# EAGLE schematic BusPirate-ultra.v1.0b (EAGLE 9.1.3)
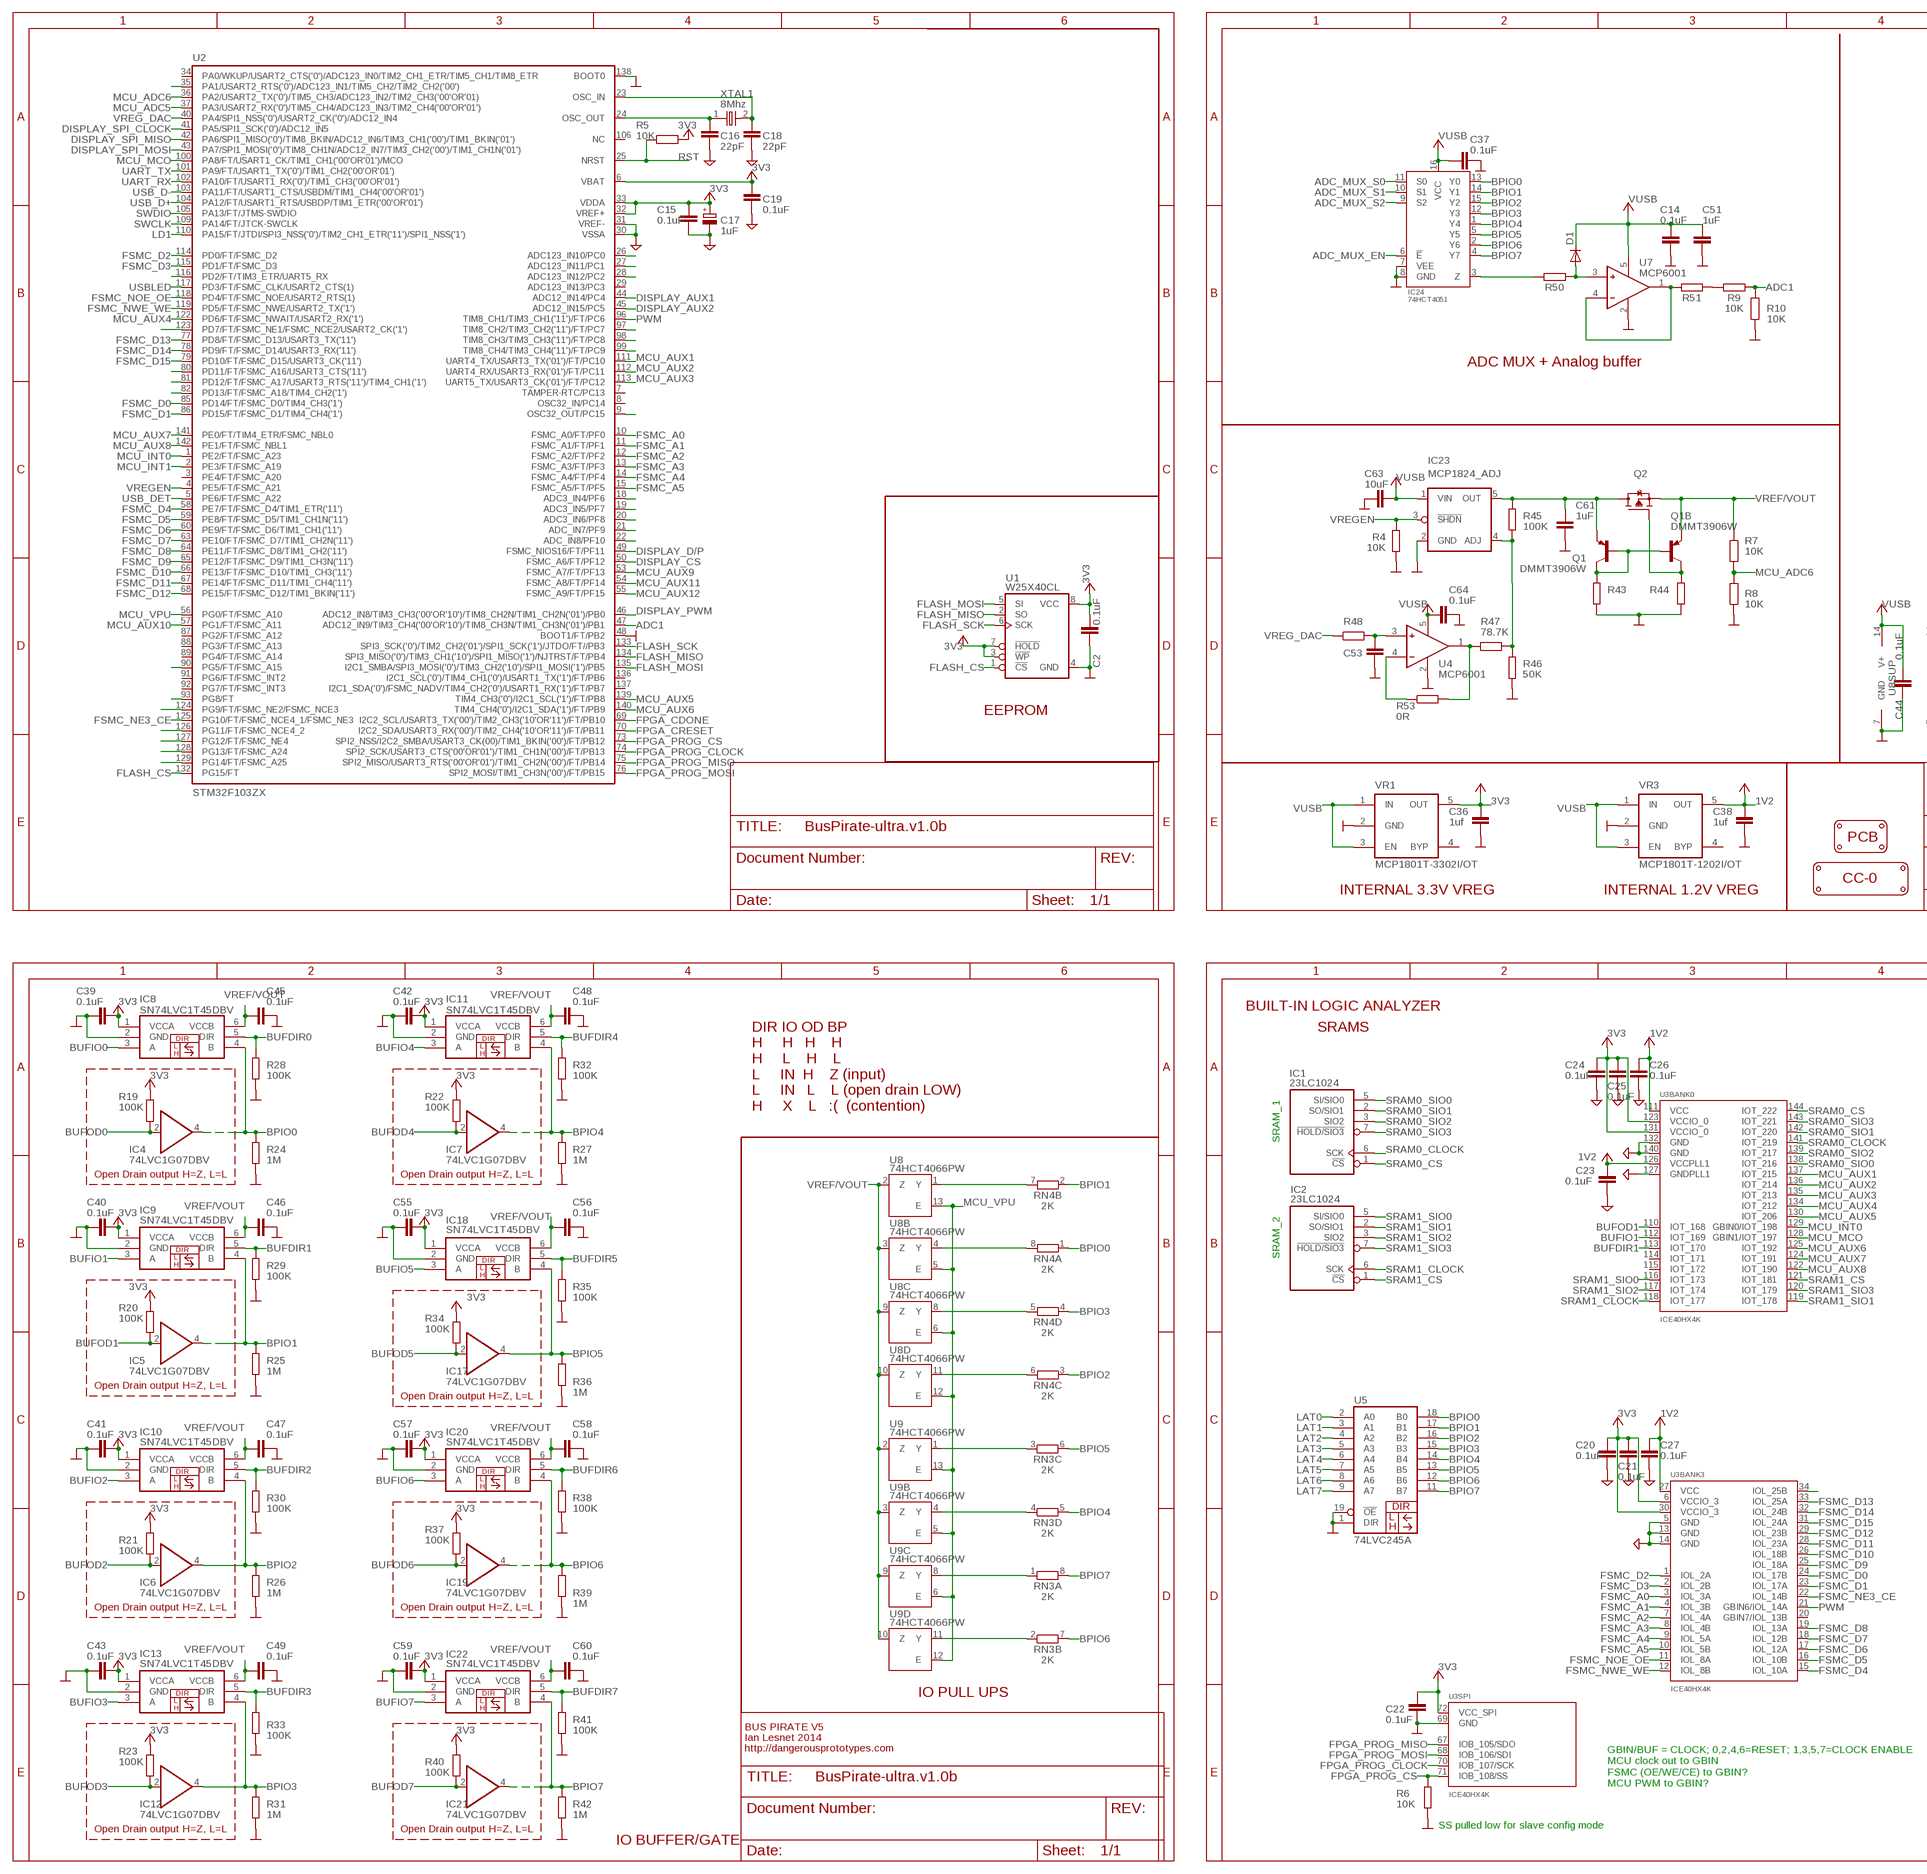
[diagram p0: schematic, sheet 1, part 1 of 2]
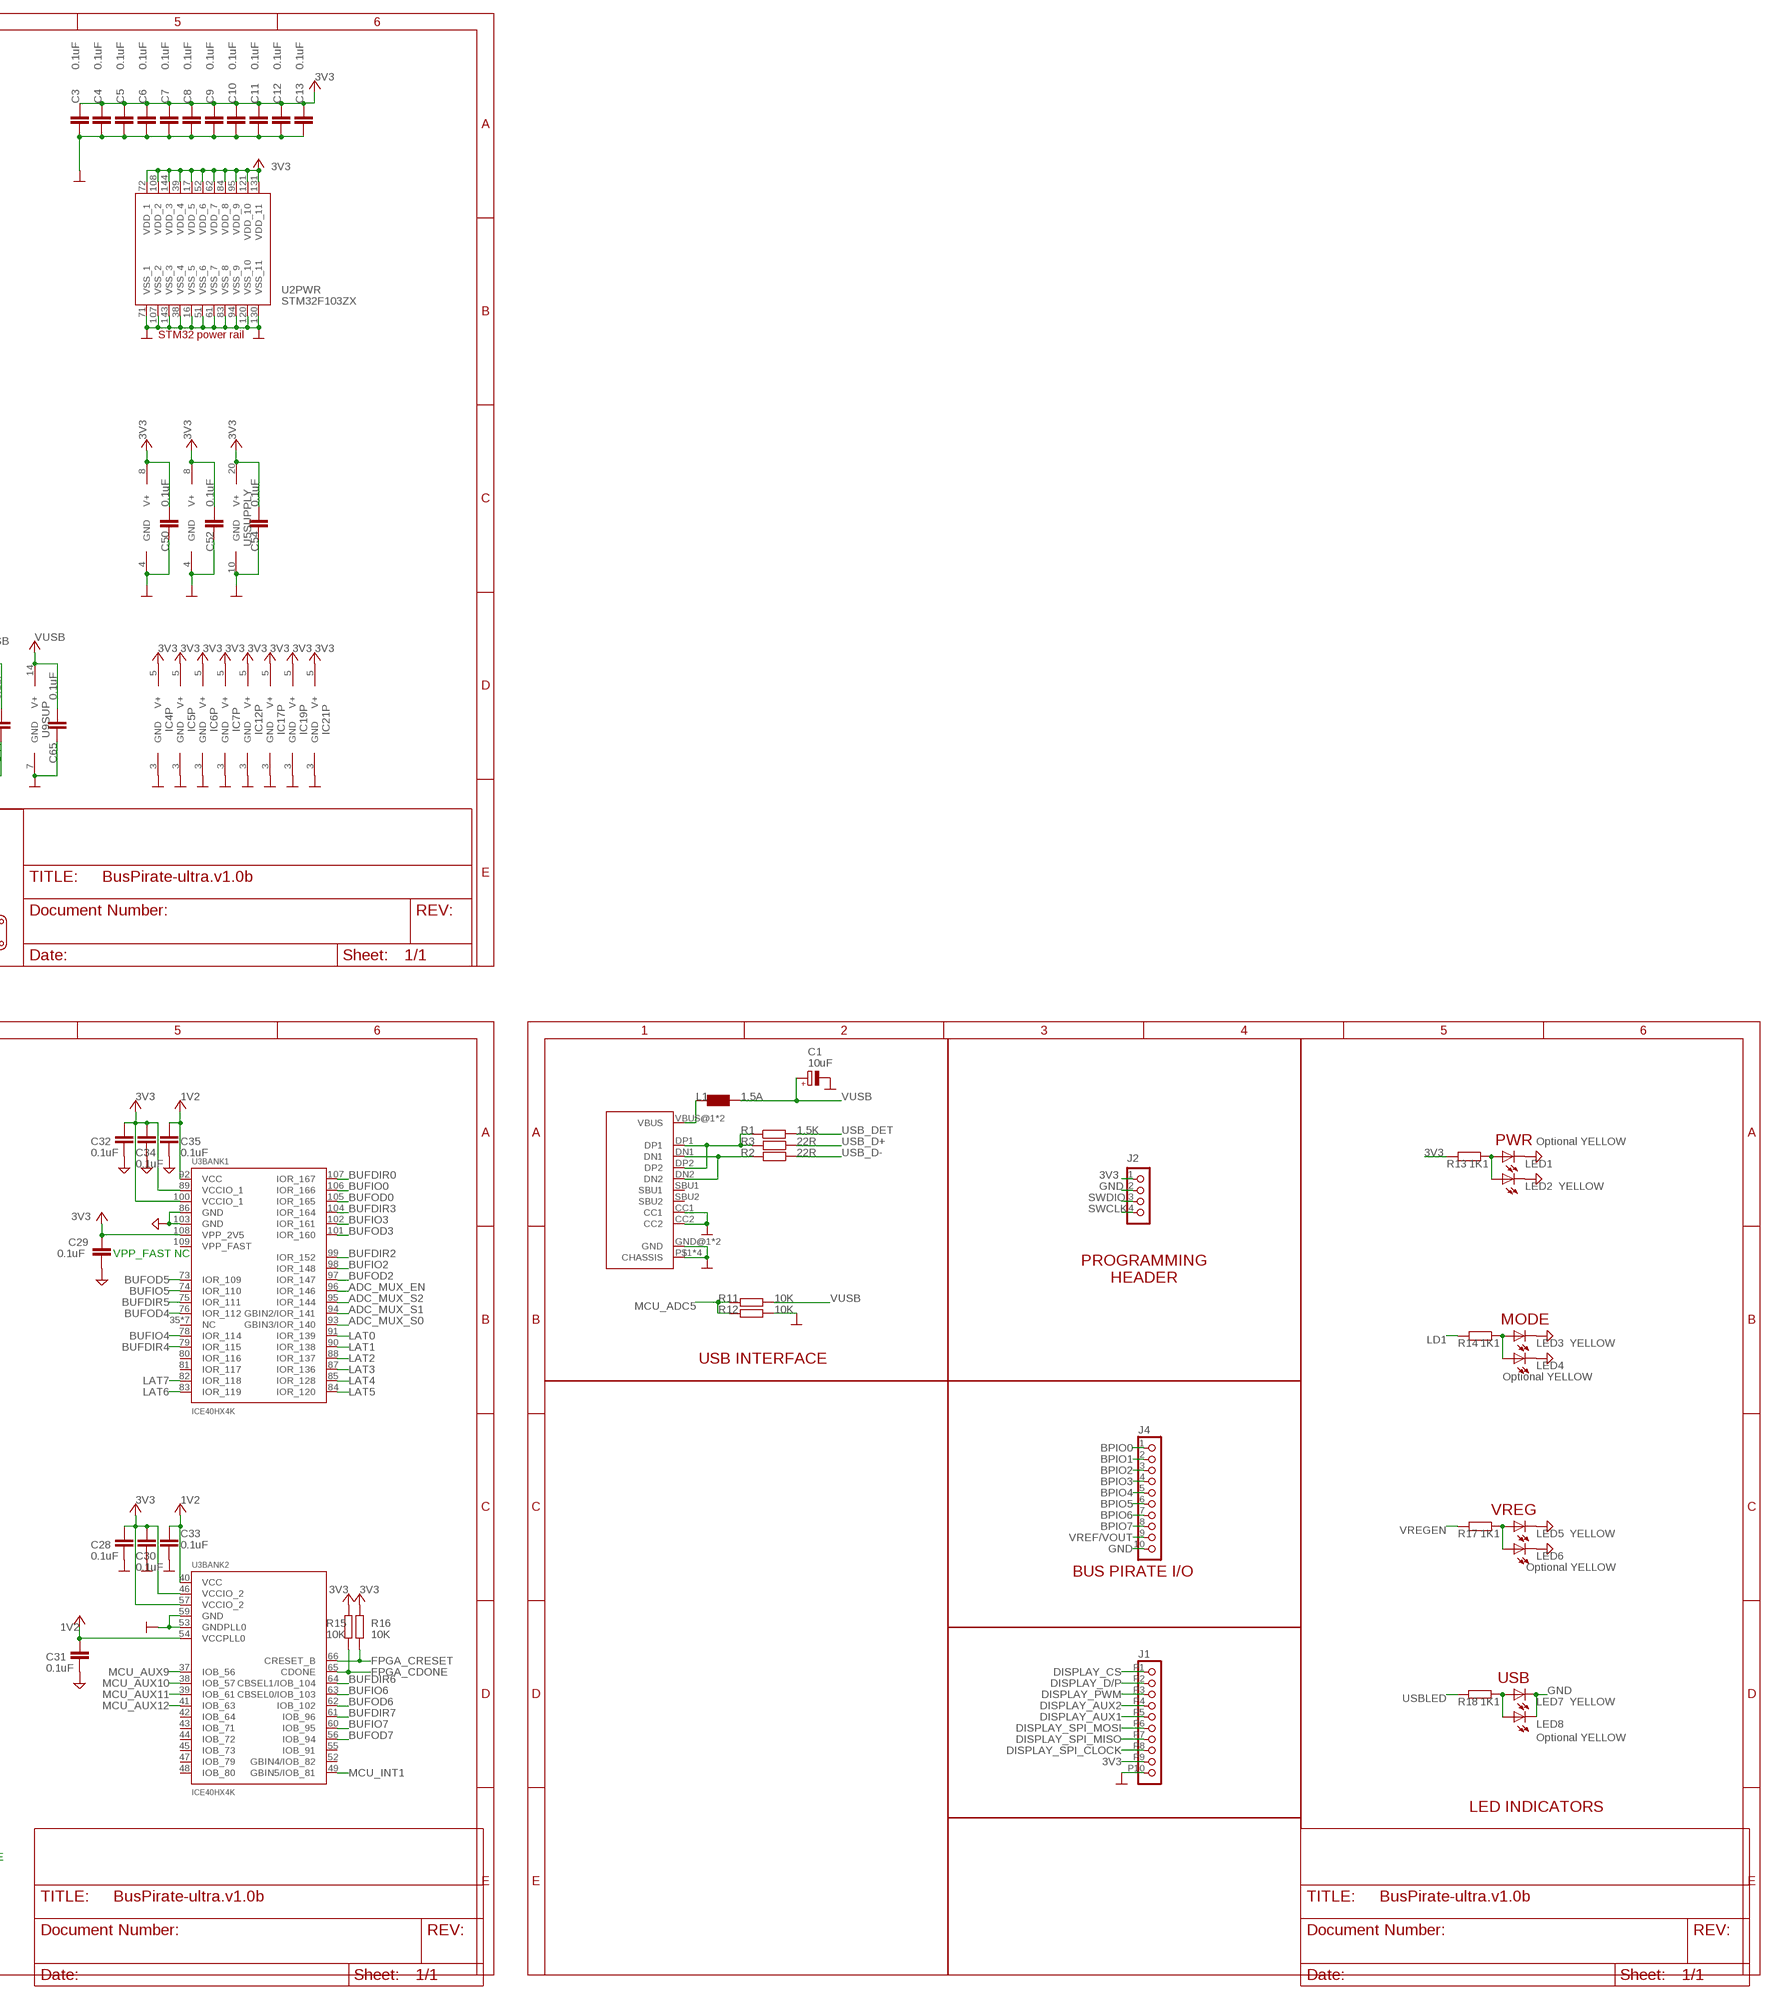
[diagram p1: schematic, sheet 1, part 2 of 2]

## Parts
C1  10uF  CPOL-EUSMCA  [SMC_A]
C2  0.1uF  C-EUC0603  [C0603]
C3  0.1uF  C-EUC0603  [C0603]
C4  0.1uF  C-EUC0603  [C0603]
C5  0.1uF  C-EUC0603  [C0603]
C6  0.1uF  C-EUC0603  [C0603]
C7  0.1uF  C-EUC0603  [C0603]
C8  0.1uF  C-EUC0603  [C0603]
C9  0.1uF  C-EUC0603  [C0603]
C10  0.1uF  CAPACITOR_NPOL-0402  [C402]
C11  0.1uF  C-EUC0603  [C0603]
C12  0.1uF  C-EUC0603  [C0603]
C13  0.1uF  C-EUC0603  [C0603]
C14  0.1uF  C-EUC0603  [C0603]
C15  0.1uF  C-EUC0603  [C0603]
C16  22pF  C-EUC0603  [C0603]
C17  1uF  CPOL-EUSMCA  [SMC_A]
C18  22pF  C-EUC0603  [C0603]
C19  0.1uF  C-EUC0603  [C0603]
C20  0.1uF  CAPACITOR_NPOL-0402  [C402]
C21  0.1uF  C-EUC0603  [C0603]
C22  0.1uF  C-EUC0603  [C0603]
C23  0.1uF  C-EUC0603  [C0603]
C24  0.1uF  C-EUC0603  [C0603]
C25  0.1uF  C-EUC0603  [C0603]
C26  0.1uF  C-EUC0603  [C0603]
C27  0.1uF  CAPACITOR_NPOL-0402  [C402]
C28  0.1uF  C-EUC0603  [C0603]
C29  0.1uF  C-EUC0603  [C0603]
C30  0.1uF  C-EUC0603  [C0603]
C31  0.1uF  C-EUC0603  [C0603]
C32  0.1uF  C-EUC0603  [C0603]
C33  0.1uF  C-EUC0603  [C0603]
C34  0.1uF  C-EUC0603  [C0603]
C35  0.1uF  C-EUC0603  [C0603]
C36  1uf  C-EUC0603  [C0603]
C37  0.1uF  C-EUC0603  [C0603]
C38  1uf  C-EUC0603  [C0603]
C39  0.1uF  C-EUC0402  [C0402]
C40  0.1uF  C-EUC0402  [C0402]
C41  0.1uF  C-EUC0402  [C0402]
C42  0.1uF  C-EUC0402  [C0402]
C43  0.1uF  C-EUC0402  [C0402]
C44  0.1uF  C-EUC0603  [C0603]
C45  0.1uF  C-EUC0402  [C0402]
C46  0.1uF  C-EUC0402  [C0402]
C47  0.1uF  C-EUC0402  [C0402]
C48  0.1uF  C-EUC0402  [C0402]
C49  0.1uF  C-EUC0402  [C0402]
C50  0.1uF  C-EUC0603  [C0603]
C51  1uF  C-EUC0603  [C0603]
C52  0.1uF  C-EUC0603  [C0603]
C53  CAPACITOR_NPOL-0603  [C603]
C54  0.1uF  C-EUC0603  [C0603]
C55  0.1uF  C-EUC0402  [C0402]
C56  0.1uF  C-EUC0402  [C0402]
C57  0.1uF  C-EUC0402  [C0402]
C58  0.1uF  C-EUC0402  [C0402]
C59  0.1uF  C-EUC0402  [C0402]
C60  0.1uF  C-EUC0402  [C0402]
C61  1uF  CAPACITOR_NPOL-0603  [C603]
C63  10uF  CAPACITOR_NPOL-0603  [C603]
C64  0.1uF  CAPACITOR_NPOL-0603  [C603]
C65  0.1uF  C-EUC0603  [C0603]
D1  DIODE-SOD-123  [SOD-123]
IC1  23LC1024  IC_MEM_23LC1024  [SOIC-8]
IC2  23LC1024  IC_MEM_23LC1024  [SOIC-8]
IC4  74LVC1G07DBV  IC_BUFF_74LVC1G07-EXTENDED  [SC-70-5_EXTENDED_PADS]
IC5  74LVC1G07DBV  IC_BUFF_74LVC1G07-EXTENDED  [SC-70-5_EXTENDED_PADS]
IC6  74LVC1G07DBV  IC_BUFF_74LVC1G07-EXTENDED  [SC-70-5_EXTENDED_PADS]
IC7  74LVC1G07DBV  IC_BUFF_74LVC1G07-EXTENDED  [SC-70-5_EXTENDED_PADS]
IC8  SN74LVC1T45DBV  IC_BUFF_SN74LVC1T45DBV-EXTENDED  [SC-70-6_EXTENDED_PADS]
IC9  SN74LVC1T45DBV  IC_BUFF_SN74LVC1T45DBV-EXTENDED  [SC-70-6_EXTENDED_PADS]
IC10  SN74LVC1T45DBV  IC_BUFF_SN74LVC1T45DBV-EXTENDED  [SC-70-6_EXTENDED_PADS]
IC11  SN74LVC1T45DBV  IC_BUFF_SN74LVC1T45DBV-EXTENDED  [SC-70-6_EXTENDED_PADS]
IC12  74LVC1G07DBV  IC_BUFF_74LVC1G07-EXTENDED  [SC-70-5_EXTENDED_PADS]
IC13  SN74LVC1T45DBV  IC_BUFF_SN74LVC1T45DBV-EXTENDED  [SC-70-6_EXTENDED_PADS]
IC17  74LVC1G07DBV  IC_BUFF_74LVC1G07-EXTENDED  [SC-70-5_EXTENDED_PADS]
IC18  SN74LVC1T45DBV  IC_BUFF_SN74LVC1T45DBV-EXTENDED  [SC-70-6_EXTENDED_PADS]
IC19  74LVC1G07DBV  IC_BUFF_74LVC1G07-EXTENDED  [SC-70-5_EXTENDED_PADS]
IC20  SN74LVC1T45DBV  IC_BUFF_SN74LVC1T45DBV-EXTENDED  [SC-70-6_EXTENDED_PADS]
IC21  74LVC1G07DBV  IC_BUFF_74LVC1G07-EXTENDED  [SC-70-5_EXTENDED_PADS]
IC22  SN74LVC1T45DBV  IC_BUFF_SN74LVC1T45DBV-EXTENDED  [SC-70-6_EXTENDED_PADS]
IC23  MCP1824_ADJ  IC_MCP1824_ADJ  [SOT-23-5]
IC24  74HCT4051  IC_74HCT4051  [TSSOP-16]
J1  CON_MOLEX_MALE_SMT_SH_1.25  [MOLEX_533980771]
J2  CON_HEADER_1X04  [M1X4]
J4  CON_HEADER_1X10-RIGHT_ANGLED_PTH_SHROUDED  [M1X10_MALE_RIGHT_ANGLES_PTH_SHROUDED]
L1  1.5A  WE-KIL_0805  [WE-KI_0805_B]
LED1  Optional YELLOW  LED-0805  [LED-805]
LED2  YELLOW  LED-0805  [LED-805]
LED3  YELLOW  LED-0805  [LED-805]
LED4  Optional YELLOW  LED-0805  [LED-805]
LED5  YELLOW  LED-0805  [LED-805]
LED6  Optional YELLOW  LED-0805  [LED-805]
LED7  YELLOW  LED-0805  [LED-805]
LED8  Optional YELLOW  LED-0805  [LED-805]
LOGO1  LOGO_CC-0  [LOGO_CC-0]
PCB1  PCB_DP_RECTANGLE-50X100  [DP10050_V1]
Q1  DMMT3906W  TRANSISTOR-BJT_DMMT3906W  [SOT-363]
Q2  TRANSISTOR_FET_TSM2301CX  [SOT-23]
R1  1.5K  R-EU_R0603  [R0603]
R2  22R  R-EU_R0603  [R0603]
R3  22R  R-EU_R0603  [R0603]
R4  10K  RESISTOR-0603  [R603]
R5  10K  RESISTOR-0603  [R603]
R6  10K  RESISTOR-0603  [R603]
R7  10K  R-EU_R0603  [R0603]
R8  10K  R-EU_R0603  [R0603]
R9  10K  R-EU_R0603  [R0603]
R10  10K  R-EU_R0603  [R0603]
R11  10K  R-EU_R0603  [R0603]
R12  10K  R-EU_R0603  [R0603]
R13  1K1  RESISTOR-0603  [R603]
R14  1K1  RESISTOR-0603  [R603]
R15  10K  R-EU_R0603  [R0603]
R16  10K  R-EU_R0603  [R0603]
R17  1K1  RESISTOR-0603  [R603]
R18  1K1  RESISTOR-0603  [R603]
R19  100K  R-EU_R0402  [R0402]
R20  100K  R-EU_R0402  [R0402]
R21  100K  R-EU_R0402  [R0402]
R22  100K  R-EU_R0402  [R0402]
R23  100K  R-EU_R0402  [R0402]
R24  1M  R-EU_R0402  [R0402]
R25  1M  R-EU_R0402  [R0402]
R26  1M  R-EU_R0402  [R0402]
R27  1M  R-EU_R0402  [R0402]
R28  100K  R-EU_R0402  [R0402]
R29  100K  R-EU_R0402  [R0402]
R30  100K  R-EU_R0402  [R0402]
R31  1M  R-EU_R0402  [R0402]
R32  100K  R-EU_R0402  [R0402]
R33  100K  R-EU_R0402  [R0402]
R34  100K  R-EU_R0402  [R0402]
R35  100K  R-EU_R0402  [R0402]
R36  1M  R-EU_R0402  [R0402]
R37  100K  R-EU_R0402  [R0402]
R38  100K  R-EU_R0402  [R0402]
R39  1M  R-EU_R0402  [R0402]
R40  100K  R-EU_R0402  [R0402]
R41  100K  R-EU_R0402  [R0402]
R42  1M  R-EU_R0402  [R0402]
R43  RESISTOR-0603  [R603]
R44  RESISTOR-0603  [R603]
R45  100K  RESISTOR-0603  [R603]
R46  50K  RESISTOR-0603  [R603]
R47  78.7K  RESISTOR-0603  [R603]
R48  RESISTOR-0603  [R603]
R50  R-EU_R0603  [R0603]
R51  R-EU_R0603  [R0603]
R53  0R  RESISTOR-0603  [R603]
RN3  2K  RNETWORK  [RN8P-4R-CRA06S]
RN4  2K  RNETWORK  [RN8P-4R-CRA06S]
U1  W25X40CL  IC_MEM_W25X40CL  [SOIC-8]
U2  STM32F103ZX  IC_UC_STM32F103ZX  [TQFP-144]
U3  ICE40HX4K  IC_FPGA_ICE40HX4K  [TQFP-144]
U4  MCP6001  IC_OP-AMP_MCP6001  [SOT-23-5]
U5  74LVC245A  IC_BUFF_74LVC245A-TSSOP20  [TSSOP-20]
U7  MCP6001  IC_MCP6001  [SOT-23-5]
U8  74HCT4066PW  IC_74HCT4066PW  [TSSOP-14]
U9  74HCT4066PW  IC_74HCT4066PW  [TSSOP-14]
U$3  USB-C-12  [C-31-M-12]
VR1  MCP1801T-3302I/OT  MIC5205  [SOT-23-5@1]
VR3  MCP1801T-1202I/OT  MIC5205  [SOT-23-5@1]
XTAL1  8Mhz  OSC-XTAL-12M  [XTAL_4X6]

## Nets
1V2: C23.2 C26.2 C27.1 C31.2 C33.2 C35.2 C38.1 U3.27(BANK3:VCC) U3.40(BANK2:VCC) U3.54(BANK2:VCCPLL0) U3.92(BANK1:VCC) U3.111(BANK0:VCC) U3.126(BANK0:VCCPLL1) VR3.5(OUT) ; supply symbol labelled SUPPLY_+3V3
3V3: C2.2 C3.2 C4.2 C5.2 C6.2 C7.2 C8.2 C9.2 C10.1 C11.2 C12.2 C13.2 C15.2 C17.+ C19.2 C20.1 C21.2 C22.2 C24.2 C25.2 C28.2 C29.2 C30.2 C32.2 C34.2 C36.1 C39.1 C40.1 C41.1 C42.1 C43.1 C50.1 C52.1 C54.1 C55.1 C57.1 C59.1 IC1.8(V+) IC2.8(V+) IC4.5(V+) IC5.5(V+) IC6.5(V+) IC7.5(V+) IC8.1(VCCA) IC9.1(VCCA) IC10.1(VCCA) IC11.1(VCCA) IC12.5(V+) IC13.1(VCCA) IC17.5(V+) IC18.1(VCCA) IC19.5(V+) IC20.1(VCCA) IC21.5(V+) IC22.1(VCCA) J1.P9 J2.1 R5.2 R13.2 R15.2 R16.2 R19.2 R20.2 R21.2 R22.2 R23.2 R34.2 R37.2 R40.2 U1.3(!WP) U1.7(!HOLD) U1.8(VCC) U2.6(VBAT) U2.17(VDD_5) U2.32(VREF+) U2.33(VDDA) U2.39(VDD_4) U2.52(VDD_6) U2.62(VDD_7) U2.72(VDD_1) U2.84(VDD_8) U2.95(VDD_9) U2.108(VDD_2) U2.121(VDD_10) U2.131(VDD_11) U2.144(VDD_3) U3.6(BANK3:VCCIO_3) U3.30(BANK3:VCCIO_3) U3.46(BANK2:VCCIO_2) U3.57(BANK2:VCCIO_2) U3.72(SPI:VCC_SPI) U3.89(BANK1:VCCIO_1) U3.100(BANK1:VCCIO_1) U3.108(BANK1:VPP_2V5) U3.123(BANK0:VCCIO_0) U3.131(BANK0:VCCIO_0) U5.20(V+) VR1.5(OUT) ; supply symbol labelled V+, SUPPLY_+3V3, VCC
ADC1: R9.2 R10.2 U2.47(ADC12_IN9/TIM3_CH4('00'OR'10')/TIM8_CH3N/TIM1_CH3N('01')/PB1)
ADC_MUX_EN: IC24.6(!E) U3.96(BANK1:IOR_146)
ADC_MUX_S0: IC24.11(S0) U3.93(BANK1:GBIN3/IOR_140)
ADC_MUX_S1: IC24.10(S1) U3.94(BANK1:GBIN2/IOR_141)
ADC_MUX_S2: IC24.9(S2) U3.95(BANK1:IOR_144)
BPIO0: IC4.4(O) IC8.4(B) IC24.13(Y0) J4.1 R24.2 RN4.1 U5.18(B0)
BPIO1: IC5.4(O) IC9.4(B) IC24.14(Y1) J4.2 R25.2 RN4.2 U5.17(B1)
BPIO2: IC6.4(O) IC10.4(B) IC24.15(Y2) J4.3 R26.2 RN4.3 U5.16(B2)
BPIO3: IC12.4(O) IC13.4(B) IC24.12(Y3) J4.4 R31.2 RN4.4 U5.15(B3)
BPIO4: IC7.4(O) IC11.4(B) IC24.1(Y4) J4.5 R27.2 RN3.5 U5.14(B4)
BPIO5: IC17.4(O) IC18.4(B) IC24.5(Y5) J4.6 R36.2 RN3.6 U5.13(B5)
BPIO6: IC19.4(O) IC20.4(B) IC24.2(Y6) J4.7 R39.2 RN3.7 U5.12(B6)
BPIO7: IC21.4(O) IC22.4(B) IC24.4(Y7) J4.8 R42.2 RN3.8 U5.11(B7)
BUFDIR0: IC8.5(DIR) R28.2 U3.107(BANK1:IOR_167)
BUFDIR1: IC9.5(DIR) R29.2 U3.113(BANK0:IOT_170)
BUFDIR2: IC10.5(DIR) R30.2 U3.99(BANK1:IOR_152)
BUFDIR3: IC13.5(DIR) R33.2 U3.104(BANK1:IOR_164)
BUFDIR4: IC11.5(DIR) R32.2 U3.79(BANK1:IOR_115)
BUFDIR5: IC18.5(DIR) R35.2 U3.75(BANK1:IOR_111)
BUFDIR6: IC20.5(DIR) R38.2 U3.64(BANK2:CBSEL1/IOB_104)
BUFDIR7: IC22.5(DIR) R41.2 U3.61(BANK2:IOB_96)
BUFIO0: IC8.3(A) U3.106(BANK1:IOR_166)
BUFIO1: IC9.3(A) U3.112(BANK0:IOT_169)
BUFIO2: IC10.3(A) U3.98(BANK1:IOR_148)
BUFIO3: IC13.3(A) U3.102(BANK1:IOR_161)
BUFIO4: IC11.3(A) U3.78(BANK1:IOR_114)
BUFIO5: IC18.3(A) U3.74(BANK1:IOR_110)
BUFIO6: IC20.3(A) U3.63(BANK2:CBSEL0/IOB_103)
BUFIO7: IC22.3(A) U3.60(BANK2:IOB_95)
BUFOD0: IC4.2(I) R19.1 U3.105(BANK1:IOR_165)
BUFOD1: IC5.2(I) R20.1 U3.110(BANK0:IOT_168)
BUFOD2: IC6.2(I) R21.1 U3.97(BANK1:IOR_147)
BUFOD3: IC12.2(I) R23.1 U3.101(BANK1:IOR_160)
BUFOD4: IC7.2(I) R22.1 U3.76(BANK1:IOR_112)
BUFOD5: IC17.2(I) R34.1 U3.73(BANK1:IOR_109)
BUFOD6: IC19.2(I) R37.1 U3.62(BANK2:IOB_102)
BUFOD7: IC21.2(I) R40.1 U3.56(BANK2:IOB_94)
D+: R1.1 R3.2 U$3.DP1 U$3.DP2
D-: R2.2 U$3.DN1 U$3.DN2
DISPLAY_AUX1: J1.P5 U2.44(ADC12_IN14/PC4)
DISPLAY_AUX2: J1.P4 U2.45(ADC12_IN15/PC5)
DISPLAY_CS: J1.P1 U2.50(FSMC_A6/FT/PF12)
DISPLAY_D/P: J1.P2 U2.49(FSMC_NIOS16/FT/PF11)
DISPLAY_PWM: J1.P3 U2.46(ADC12_IN8/TIM3_CH3('00'OR'10')/TIM8_CH2N/TIM1_CH2N('01')/PB0)
DISPLAY_SPI_CLOCK: J1.P8 U2.41(PA5/SPI1_SCK('0')/ADC12_IN5)
DISPLAY_SPI_MISO: J1.P7 U2.42(PA6/SPI1_MISO('0')/TIM8_BKIN/ADC12_IN6/TIM3_CH1('00')/TIM1_BKIN('01'))
DISPLAY_SPI_MOSI: J1.P6 U2.43(PA7/SPI1_MOSI('0')/TIM8_CH1N/ADC12_IN7/TIM3_CH2('00')/TIM1_CH1N('01'))
FLASH_CS: U1.1(!CS) U2.132(PG15/FT)
FLASH_MISO: U1.2(SO) U2.134(SPI3_MISO('0')/TIM3_CH1('10')/SPI1_MISO('1')/NJTRST/FT/PB4)
FLASH_MOSI: U1.5(SI) U2.135(I2C1_SMBA/SPI3_MOSI('0')/TIM3_CH2('10')/SPI1_MOSI('1')/PB5)
FLASH_SCK: U1.6(SCK) U2.133(SPI3_SCK('0')/TIM2_CH2('01')/SPI1_SCK('1')/JTDO/FT//PB3)
FPGA_CDONE: R15.1 U2.69(I2C2_SCL/USART3_TX('00')/TIM2_CH3('10'OR'11')/FT/PB10) U3.65(BANK2:CDONE)
FPGA_CRESET: R16.1 U2.70(I2C2_SDA/USART3_RX('00')/TIM2_CH4('10'OR'11')/FT/PB11) U3.66(BANK2:CRESET_B)
FPGA_PROG_CLOCK: U2.74(SPI2_SCK/USART3_CTS('00'OR'01')/TIM1_CH1N('00')/FT/PB13) U3.70(SPI:IOB_107/SCK)
FPGA_PROG_CS: R6.1 U2.73(SPI2_NSS/I2C2_SMBA/USART3_CK(00)/TIM1_BKIN('00')/FT/PB12) U3.71(SPI:IOB_108/SS)
FPGA_PROG_MISO: U2.75(SPI2_MISO/USART3_RTS('00'OR'01')/TIM1_CH2N('00')/FT/PB14) U3.67(SPI:IOB_105/SDO)
FPGA_PROG_MOSI: U2.76(SPI2_MOSI/TIM1_CH3N('00')/FT/PB15) U3.68(SPI:IOB_106/SDI)
FSMC_A0: U2.10(FSMC_A0/FT/PF0) U3.3(BANK3:IOL_3A)
FSMC_A1: U2.11(FSMC_A1/FT/PF1) U3.4(BANK3:IOL_3B)
FSMC_A2: U2.12(FSMC_A2/FT/PF2) U3.7(BANK3:IOL_4A)
FSMC_A3: U2.13(FSMC_A3/FT/PF3) U3.8(BANK3:IOL_4B)
FSMC_A4: U2.14(FSMC_A4/FT/PF4) U3.9(BANK3:IOL_5A)
FSMC_A5: U2.15(FSMC_A5/FT/PF5) U3.10(BANK3:IOL_5B)
FSMC_D0: U2.85(PD14/FT/FSMC_D0/TIM4_CH3('1')) U3.24(BANK3:IOL_17B)
FSMC_D1: U2.86(PD15/FT/FSMC_D1/TIM4_CH4('1')) U3.23(BANK3:IOL_17A)
FSMC_D2: U2.114(PD0/FT/FSMC_D2) U3.1(BANK3:IOL_2A)
FSMC_D3: U2.115(PD1/FT/FSMC_D3) U3.2(BANK3:IOL_2B)
FSMC_D4: U2.58(PE7/FT/FSMC_D4/TIM1_ETR('11')) U3.15(BANK3:IOL_10A)
FSMC_D5: U2.59(PE8/FT/FSMC_D5/TIM1_CH1N('11')) U3.16(BANK3:IOL_10B)
FSMC_D6: U2.60(PE9/FT/FSMC_D6/TIM1_CH1('11')) U3.17(BANK3:IOL_12A)
FSMC_D7: U2.63(PE10/FT/FSMC_D7/TIM1_CH2N('11')) U3.18(BANK3:IOL_12B)
FSMC_D8: U2.64(PE11/FT/FSMC_D8/TIM1_CH2('11')) U3.19(BANK3:IOL_13A)
FSMC_D9: U2.65(PE12/FT/FSMC_D9/TIM1_CH3N('11')) U3.25(BANK3:IOL_18A)
FSMC_D10: U2.66(PE13/FT/FSMC_D10/TIM1_CH3('11')) U3.26(BANK3:IOL_18B)
FSMC_D11: U2.67(PE14/FT/FSMC_D11/TIM1_CH4('11')) U3.28(BANK3:IOL_23A)
FSMC_D12: U2.68(PE15/FT/FSMC_D12/TIM1_BKIN('11')) U3.29(BANK3:IOL_23B)
FSMC_D13: U2.77(PD8/FT/FSMC_D13/USART3_TX('11')) U3.33(BANK3:IOL_25A)
FSMC_D14: U2.78(PD9/FT/FSMC_D14/USART3_RX('11')) U3.32(BANK3:IOL_24B)
FSMC_D15: U2.79(PD10/FT/FSMC_D15/USART3_CK('11')) U3.31(BANK3:IOL_24A)
FSMC_NE3_CE: U2.125(PG10/FT/FSMC_NCE4_1/FSMC_NE3) U3.22(BANK3:IOL_14B)
FSMC_NOE_OE: U2.118(PD4/FT/FSMC_NOE/USART2_RTS(1)) U3.11(BANK3:IOL_8A)
FSMC_NWE_WE: U2.119(PD5/FT/FSMC_NWE/USART2_TX('1')) U3.12(BANK3:IOL_8B)
GND: C1.- C2.1 C3.1 C4.1 C5.1 C6.1 C7.1 C8.1 C9.1 C10.2 C11.1 C12.1 C13.1 C14.2 C15.1 C16.1 C17.- C18.1 C19.1 C20.2 C21.1 C22.1 C23.1 C24.1 C25.1 C26.1 C27.2 C28.1 C29.1 C30.1 C31.1 C32.1 C33.1 C34.1 C35.1 C36.2 C37.2 C38.2 C39.2 C40.2 C41.2 C42.2 C43.2 C44.2 C45.1 C46.1 C47.1 C48.1 C49.1 C50.2 C51.2 C52.2 C53.2 C54.2 C55.2 C56.1 C57.2 C58.1 C59.2 C60.1 C61.2 C63.2 C64.2 C65.2 IC1.4(GND) IC2.4(GND) IC4.3(GND) IC5.3(GND) IC6.3(GND) IC7.3(GND) IC8.2(GND) IC9.2(GND) IC10.2(GND) IC11.2(GND) IC12.3(GND) IC13.2(GND) IC17.3(GND) IC18.2(GND) IC19.3(GND) IC20.2(GND) IC21.3(GND) IC22.2(GND) IC23.2(GND) IC24.7(VEE) IC24.8(GND) J1.P10 J2.2 J4.10 LED1.C LED2.C LED3.C LED4.C LED5.C LED6.C LED7.C LED8.C R4.2 R6.2 R8.1 R10.1 R12.1 R24.1 R25.1 R26.1 R27.1 R28.1 R29.1 R30.1 R31.1 R32.1 R33.1 R35.1 R36.1 R38.1 R39.1 R41.1 R42.1 R43.1 R44.1 R46.2 U1.4(GND) U2.16(VSS_5) U2.30(VSSA) U2.31(VREF-) U2.38(VSS_4) U2.48(BOOT1/FT/PB2) U2.51(VSS_6) U2.61(VSS_7) U2.71(VSS_1) U2.83(VSS_8) U2.94(VSS_9) U2.107(VSS_2) U2.120(VSS_10) U2.130(VSS_11) U2.138(BOOT0) U2.143(VSS_3) U3.5(BANK3:GND) U3.13(BANK3:GND) U3.14(BANK3:GND) U3.53(BANK2:GNDPLL0) U3.59(BANK2:GND) U3.69(SPI:GND) U3.86(BANK1:GND) U3.103(BANK1:GND) U3.127(BANK0:GNDPLL1) U3.132(BANK0:GND) U3.140(BANK0:GND) U4.2(V-) U5.1(DIR) U5.10(GND) U5.19(!OE) U7.2(V-) U8.7(GND) U9.7(GND) U$3.CC1 U$3.CC2 U$3.GND@1(GND) U$3.GND@2(GND) U$3.P$1(CHASSIS) U$3.P$2(CHASSIS) U$3.P$3(CHASSIS) U$3.P$4(CHASSIS) VR1.2(GND) VR3.2(GND) ; supply symbol labelled SUPPLY_GND
LAT0: U3.91(BANK1:IOR_139) U5.2(A0)
LAT1: U3.90(BANK1:IOR_138) U5.3(A1)
LAT2: U3.88(BANK1:IOR_137) U5.4(A2)
LAT3: U3.87(BANK1:IOR_136) U5.5(A3)
LAT4: U3.85(BANK1:IOR_128) U5.6(A4)
LAT5: U3.84(BANK1:IOR_120) U5.7(A5)
LAT6: U3.83(BANK1:IOR_119) U5.8(A6)
LAT7: U3.82(BANK1:IOR_118) U5.9(A7)
LD1: R14.2 U2.110(PA15/FT/JTDI/SPI3_NSS('0')/TIM2_CH1_ETR('11')/SPI1_NSS('1'))
MCU_ADC5: R11.2 R12.2 U2.37(PA3/USART2_RX('0')/TIM5_CH4/ADC123_IN3/TIM2_CH4('00'OR'01'))
MCU_ADC6: R7.2 R8.2 U2.36(PA2/USART2_TX('0')/TIM5_CH3/ADC123_IN2/TIM2_CH3('00'OR'01))
MCU_AUX1: U2.111(UART4_TX/USART3_TX('01')/FT/PC10) U3.137(BANK0:IOT_215)
MCU_AUX2: U2.112(UART4_RX/USART3_RX('01')/FT/PC11) U3.136(BANK0:IOT_214)
MCU_AUX3: U2.113(UART5_TX/USART3_CK('01')/FT/PC12) U3.135(BANK0:IOT_213)
MCU_AUX4: U2.122(PD6/FT/FSMC_NWAIT/USART2_RX('1')) U3.134(BANK0:IOT_212)
MCU_AUX5: U2.139(TIM4_CH3('0')/I2C1_SCL('1')/FT/PB8) U3.130(BANK0:IOT_206)
MCU_AUX6: U2.140(TIM4_CH4('0')/I2C1_SDA('1')/FT/PB9) U3.125(BANK0:IOT_192)
MCU_AUX7: U2.141(PE0/FT/TIM4_ETR/FSMC_NBL0) U3.124(BANK0:IOT_191)
MCU_AUX8: U2.142(PE1/FT/FSMC_NBL1) U3.122(BANK0:IOT_190)
MCU_AUX9: U2.53(FSMC_A7/FT/PF13) U3.37(BANK2:IOB_56)
MCU_AUX10: U2.57(PG1/FT/FSMC_A11) U3.38(BANK2:IOB_57)
MCU_AUX11: U2.54(FSMC_A8/FT/PF14) U3.39(BANK2:IOB_61)
MCU_AUX12: U2.55(FSMC_A9/FT/PF15) U3.41(BANK2:IOB_63)
MCU_INT0: U2.1(PE2/FT/FSMC_A23) U3.129(BANK0:GBIN0/IOT_198)
MCU_INT1: U2.2(PE3/FT/FSMC_A19) U3.49(BANK2:GBIN5/IOB_81)
MCU_MCO: U2.100(PA8/FT/USART1_CK/TIM1_CH1('00'OR'01')/MCO) U3.128(BANK0:GBIN1/IOT_197)
MCU_VPU: U2.56(PG0/FT/FSMC_A10) U8.5(E) U8.6(E) U8.12(E) U8.13(E) U9.5(E) U9.6(E) U9.12(E) U9.13(E)
N$1: L1.2 U$3.VBUS@1(VBUS) U$3.VBUS@2(VBUS)
N$2: RN4.7 U8.1(Y)
N$3: RN4.8 U8.4(Y)
N$4: RN4.5 U8.8(Y)
N$5: RN4.6 U8.11(Y)
N$6: LED3.A LED4.A R14.1
N$7: LED1.A LED2.A R13.1
N$8: C18.2 U2.23(OSC_IN) XTAL1.2
N$9: C16.2 U2.24(OSC_OUT) XTAL1.1
N$10: U2.35(PA1/USART2_RTS('0')/ADC123_IN1/TIM5_CH2/TIM2_CH2('00'))
N$11: Q1.6(C) Q2.1(G) R44.2
N$12: IC23.4(ADJ) R45.1 R46.1 R47.2
N$13: LED7.A LED8.A R18.1
N$15: R53.1 U4.4(-)
N$16: U2.9(OSC32_OUT/PC15)
N$17: U3.34(BANK3:IOL_25B)
N$18: LED5.A LED6.A R17.1
N$19: U2.97(TIM8_CH2/TIM3_CH2('11')/FT/PC7)
N$22: U2.98(TIM8_CH3/TIM3_CH3('11')/FT/PC8)
N$23: U2.28(ADC123_IN12/PC2)
N$25: R47.1 R53.2 U4.1(OUT)
N$26: C61.1 IC23.5(OUT) Q1.4(E) Q2.3(D) R45.2
N$27: Q1.1(B) Q1.2(B) Q1.3(C) R43.2
N$28: U2.80(PD11/FT/FSMC_A16/USART3_CTS('11'))
N$29: U2.116(PD2/FT/TIM3_ETR/UART5_RX)
N$30: U2.26(ADC123_IN10/PC0)
N$31: C53.1 R48.2 U4.3(+)
N$32: D1.A R50.2 U7.3(+)
N$33: RN3.3 U9.1(Y)
N$34: U2.82(PD13/FT/FSMC_A18/TIM4_CH2('1'))
N$35: U2.27(ADC123_IN11/PC1)
N$36: U2.18(ADC3_IN4/PF6)
N$37: U2.19(ADC3_IN5/PF7)
N$38: U2.20(ADC3_IN6/PF8)
N$39: U2.21(ADC_IN7/PF9)
N$40: U2.22(ADC_IN8/PF10)
N$41: U2.99(TIM8_CH4/TIM3_CH4('11')/FT/PC9)
N$42: RN3.4 U9.4(Y)
N$43: U2.81(PD12/FT/FSMC_A17/USART3_RTS('11')/TIM4_CH1('1'))
N$44: RN3.1 U9.8(Y)
N$45: RN3.2 U9.11(Y)
N$52: U2.90(PG5/FT/FSMC_A15)
N$53: U2.93(PG8/FT)
N$54: U2.124(PG9/FT/FSMC_NE2/FSMC_NCE3)
N$56: U2.123(PD7/FT/FSMC_NE1/FSMC_NCE2/USART2_CK('1'))
N$57: U2.126(PG11/FT/FSMC_NCE4_2)
N$58: U2.127(PG12/FT/FSMC_NE4)
N$59: U2.128(PG13/FT/FSMC_A24)
N$60: U2.129(PG14/FT/FSMC_A25)
N$61: IC24.3(Z) R50.1
N$64: R51.1 U7.1(OUT) U7.4(-)
N$65: R9.1 R51.2
PWM: U2.96(TIM8_CH1/TIM3_CH1('11')/FT/PC6) U3.21(BANK3:GBIN6/IOL_14A)
RST: R5.1 U2.25(NRST)
SRAM0_CLOCK: IC1.6(SCK) U3.141(BANK0:IOT_219)
SRAM0_CS: IC1.1(!CS) U3.144(BANK0:IOT_222)
SRAM0_SIO0: IC1.5(SI/SIO0) U3.138(BANK0:IOT_216)
SRAM0_SIO1: IC1.2(SO/SIO1) U3.142(BANK0:IOT_220)
SRAM0_SIO2: IC1.3(SIO2) U3.139(BANK0:IOT_217)
SRAM0_SIO3: IC1.7(!HOLD/SIO3) U3.143(BANK0:IOT_221)
SRAM1_CLOCK: IC2.6(SCK) U3.118(BANK0:IOT_177)
SRAM1_CS: IC2.1(!CS) U3.121(BANK0:IOT_181)
SRAM1_SIO0: IC2.5(SI/SIO0) U3.116(BANK0:IOT_173)
SRAM1_SIO1: IC2.2(SO/SIO1) U3.119(BANK0:IOT_178)
SRAM1_SIO2: IC2.3(SIO2) U3.117(BANK0:IOT_174)
SRAM1_SIO3: IC2.7(!HOLD/SIO3) U3.120(BANK0:IOT_179)
SWCLK: J2.4 U2.109(PA14/FT/JTCK-SWCLK)
SWDIO: J2.3 U2.105(PA13/FT/JTMS-SWDIO)
UART_RX: U2.102(PA10/FT/USART1_RX('0')/TIM1_CH3('00'OR'01'))
UART_TX: U2.101(PA9/FT/USART1_TX('0')/TIM1_CH2('00'OR'01'))
USB_D+: R3.1 U2.104(PA12/FT/USART1_RTS/USBDP/TIM1_ETR('00'OR'01'))
USB_D-: R2.1 U2.103(PA11/FT/USART1_CTS/USBDM/TIM1_CH4('00'OR'01'))
USB_DET: R1.2 U2.5(PE6/FT/FSMC_A22)
USBLED: R18.2 U2.117(PD3/FT/FSMC_CLK/USART2_CTS(1))
VREF/VOUT: C45.2 C46.2 C47.2 C48.2 C49.2 C56.2 C58.2 C60.2 IC8.6(VCCB) IC9.6(VCCB) IC10.6(VCCB) IC11.6(VCCB) IC13.6(VCCB) IC18.6(VCCB) IC20.6(VCCB) IC22.6(VCCB) J4.9 Q1.5(E) Q2.2(S) R7.1 U8.2(Z) U8.3(Z) U8.9(Z) U8.10(Z) U9.2(Z) U9.3(Z) U9.9(Z) U9.10(Z)
VREG_DAC: R48.1 U2.40(PA4/SPI1_NSS('0')/USART2_CK('0')/ADC12_IN4)
VREGEN: IC23.3(!SHDN) R4.1 R17.2 U2.4(PE5/FT/FSMC_A21)
VUSB: C1.+ C14.1 C37.1 C44.1 C51.1 C63.1 C64.1 C65.1 D1.C IC23.1(VIN) IC24.16(VCC) L1.1 R11.1 U4.5(V+) U7.5(V+) U8.14(V+) U9.14(V+) VR1.1(IN) VR1.3(EN) VR3.1(IN) VR3.3(EN) ; supply symbol labelled V+
Unconnected: U2.3(PE4/FT/FSMC_A20) U2.7(TAMPER-RTC/PC13) U2.8(OSC32_IN/PC14) U2.29(ADC123_IN13/PC3) U2.34(PA0/WKUP/USART2_CTS('0')/ADC123_IN0/TIM2_CH1_ETR/TIM5_CH1/TIM8_ETR) U2.87(PG2/FT/FSMC_A12) U2.88(PG3/FT/FSMC_A13) U2.89(PG4/FT/FSMC_A14) U2.91(PG6/FT/FSMC_INT2) U2.92(PG7/FT/FSMC_INT3) U2.106(NC) U2.136(I2C1_SCL('0')/TIM4_CH1('0')/USART1_TX('1')/FT/PB6) U2.137(I2C1_SDA('0')/FSMC_NADV/TIM4_CH2('0')/USART1_RX('1')/FT/PB7) U3.20(BANK3:GBIN7/IOL_13B) U3.35(BANK1:NC) U3.36(BANK1:NC) U3.42(BANK2:IOB_64) U3.43(BANK2:IOB_71) U3.44(BANK2:IOB_72) U3.45(BANK2:IOB_73) U3.47(BANK2:IOB_79) U3.48(BANK2:IOB_80) U3.50(BANK1:NC) U3.51(BANK1:NC) U3.52(BANK2:GBIN4/IOB_82) U3.55(BANK2:IOB_91) U3.58(BANK1:NC) U3.77(BANK1:NC) U3.80(BANK1:IOR_116) U3.81(BANK1:IOR_117) U3.114(BANK0:IOT_171) U3.115(BANK0:IOT_172) U3.133(BANK1:NC) U$3.SBU1 U$3.SBU2 VR1.4(BYP) VR3.4(BYP)

## Notes on the sheet
- STM32 power rail
- ADC MUX + Analog buffer
- EEPROM
- INTERNAL 3.3V VREG | INTERNAL 1.2V VREG
- BUILT-IN LOGIC ANALYZER
- SRAMS
- PWR
- DIR IO OD BP
  H     H   H    H
  H     L    H    L
  L     IN  H    Z (input)
  L     IN   L    L (open drain LOW)
  H     X    L   :(  (contention)
- SRAM_1
- Open Drain output H=Z, L=L | Open Drain output H=Z, L=L
- VPP_FAST NC
- PROGRAMMING
  HEADER
- MODE
- SRAM_2
- USB INTERFACE
- Open Drain output H=Z, L=L
- Open Drain output H=Z, L=L
- VREG
- BUS PIRATE I/O
- USB
- Open Drain output H=Z, L=L | Open Drain output H=Z, L=L
- IO PULL UPS
- LED INDICATORS
- BUS PIRATE V5
- Ian Lesnet 2014
- http://dangerousprototypes.com
- GBIN/BUF = CLOCK; 0,2,4,6=RESET; 1,3,5,7=CLOCK ENABLE
  MCU clock out to GBIN
  FSMC (OE/WE/CE) to GBIN?
  MCU PWM to GBIN?
- Open Drain output H=Z, L=L | Open Drain output H=Z, L=L | SS pulled low for slave config mode
- IO BUFFER/GATE

## Power pins joined to a net without a drawn wire
VPP_FAST: U3.109(BANK1:VPP_FAST)

## Library data of the parts
C1 C17 = rcl:CPOL-EU: POLARIZED CAPACITOR, European symbol
C2-C9 C11-C16 C18 C19 C21-C26 C28-C38 C44 C50-C52 C54 C65 = rcl:C-EU: CAPACITOR, European symbol
C10 C20 C27 C53 C61 C63 C64 = dp_devices.v6:CAPACITOR_NPOL: Non-Polarized capacitor in various packages
C39 C45 = rcl:C-EU: CAPACITOR, European symbol; SPICEPREFIX: C
C40-C43 C46-C49 C55-C60 = resistor:C-EU: CAPACITOR, European symbol
D1 = dp_devices.v6:DIODE: Various Diode Packages
IC1 IC2 = dp_devices:IC_MEM_23LC1024: 1Mbit SPI SRAM with Serial dual interface and Serial quad interface
IC4-IC7 IC12 IC17 IC19 IC21 = dp_devices.v6:IC_BUFF_74LVC1G07: Single buffer/driver with open drain output
IC8-IC11 IC13 IC18 IC20 IC22 = dp_devices.v6:IC_BUFF_SN74LVC1T45DBV
IC23 = dp_devices.v6:IC_MCP1824_ADJ: MCP1824 ADJ 300mA, Low voltage, Low Quiescent current adjustable LDO regulator
IC24 = dp_devices.v6:IC_74HCT4051: 74HCT4051 8-channel analog mux/demux
J1 = dp_devices.v6:CON_MOLEX_MALE_SMT_SH_1.25: Molex 1.25mm PicoBlade Header vertical SMT 10 circuits p/n: 533980771
J2 = dp_devices.v6:CON_HEADER_1X04
J4 = dp_devices.v6:CON_HEADER_1X10
L1 = wuerth-elektronik:WE-KIL: SMD Wire Wound Ceramic Inductor WE-KIL - Low profile - High Q values -- Bluetooth -- Wireless LAN -- RF oscillation circuit -- IF impedance matching
LED1-LED8 = dp_devices.v6:LED: Light Emitting Diode
LOGO1 = dp_devices:LOGO_CC-0
PCB1 = dp_blank_pcb:PCB_DP_RECTANGLE: Dangerous Prototypes Standard Rectangular PCB sizes
Q1 = dp_devices.v6:TRANSISTOR-BJT_DMMT3906W: Matched pair PNP small signal transistor -40V -200mA
Q2 = dp_devices.v6:TRANSISTOR_FET_TSM2301CX: 20V P-Channel Enhancement Mode MOSFET
R1-R3 R15 R16 = rcl:R-EU_: RESISTOR, European symbol; SPICEPREFIX: R
R4 R5 R43-R48 R53 = dp_devices.v6:RESISTOR
R6 R13 R14 R17 R18 = dp_devices:RESISTOR
R7-R12 R19-R42 R50 R51 = resistor:R-EU_: RESISTOR, European symbol
RN3 RN4 = dp_devices:RNETWORK: 4 Resistor Array 0603
U1 = dp_devices.v6:IC_MEM_W25X40CL: 4M-Bit serial flash memory with 4KB sectors and Dual I/O SPI
U2 = dp_devices.v6:IC_UC_STM32F103ZX: STM32F103ZX High-density performance line ARM based 32-bit MCU
U3 = dp_devices.v6:IC_FPGA_ICE40HX4K: iCE40HX4K iCE40™ HX ultra-low power, non-volatile FPGA
U4 = dp_devices.v6:IC_OP-AMP_MCP6001: 1 MHz, Low-Power Op Amp
U5 = dp_devices.v6:IC_BUFF_74LVC245A: Octal Bus transceiver with 3-state, 3.3V supply
U7 = dp_devices.v6:IC_MCP6001: 1 MHz, Low-Power Op Amp
U8 U9 = dp_devices.v6:IC_74HCT4066PW: Quad single-pole single-throw analog switch
U$3 = usbc:USB-C-12
VR1 VR3 = dp_devices:MIC5205: 150ma Low-Noise LDO Regulator
XTAL1 = dp_devices:OSC-XTAL